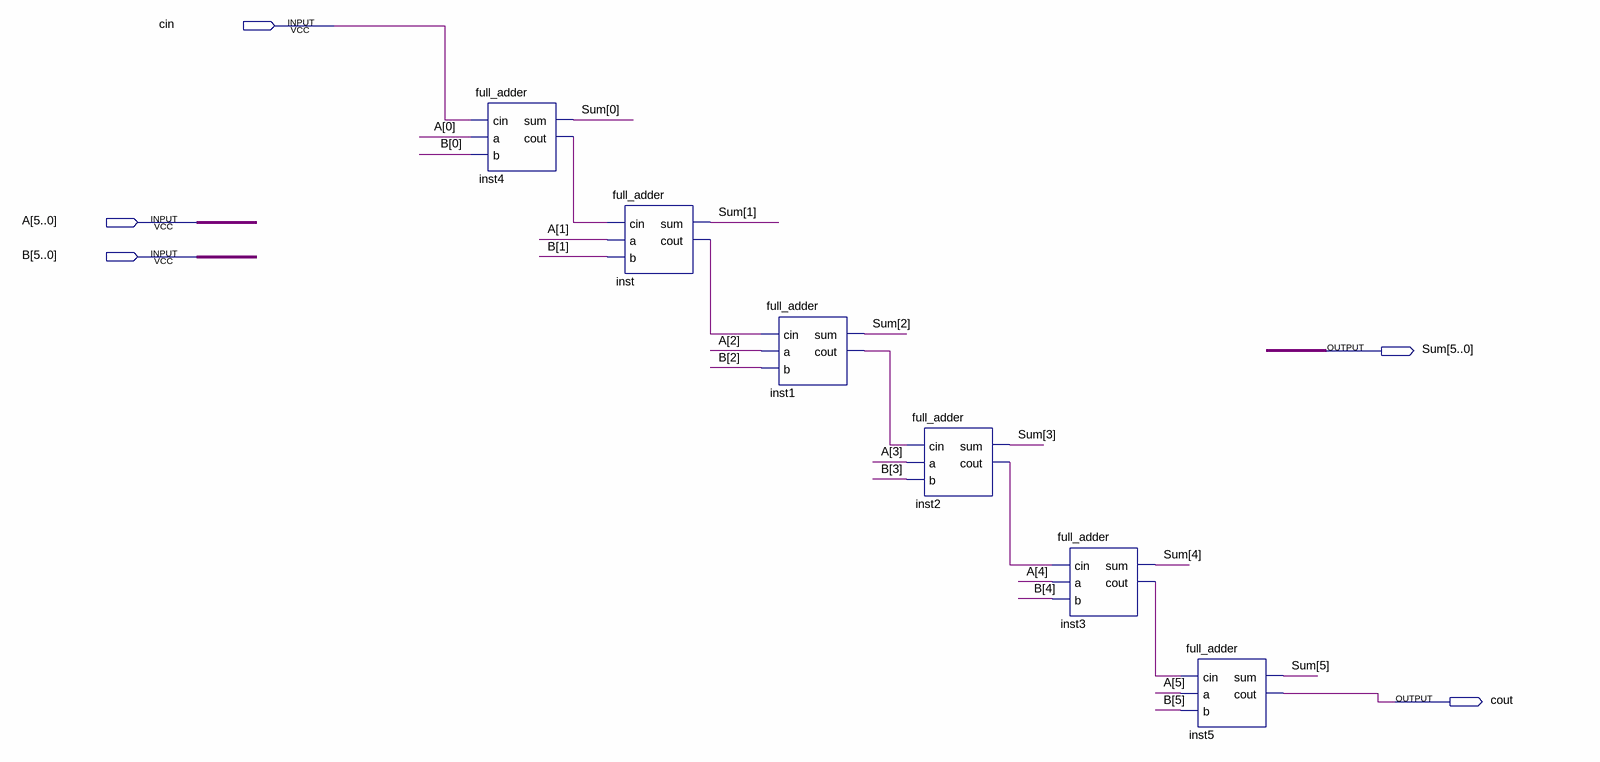
[diagram p0: schematic sheet]
// Quartus schematic adder_6bit.bdf as structural Verilog: 6 symbols, 5 pins
module adder_6bit (
  input  cin,
  input  [5:0] A,
  input  [5:0] B,
  output [5:0] Sum,
  output cout
);

  wire inst1_cout, inst2_cout, inst3_cout, inst4_cout, inst_cout;

  full_adder inst4 (.cin(cin), .a(A[0]), .b(B[0]), .sum(Sum[0]), .cout(inst4_cout));
  full_adder inst (.cin(inst4_cout), .a(A[1]), .b(B[1]), .sum(Sum[1]), .cout(inst_cout));
  full_adder inst1 (.cin(inst_cout), .a(A[2]), .b(B[2]), .sum(Sum[2]), .cout(inst1_cout));
  full_adder inst2 (.cin(inst1_cout), .a(A[3]), .b(B[3]), .sum(Sum[3]), .cout(inst2_cout));
  full_adder inst3 (.cin(inst2_cout), .a(A[4]), .b(B[4]), .sum(Sum[4]), .cout(inst3_cout));
  full_adder inst5 (.cin(inst3_cout), .a(A[5]), .b(B[5]), .sum(Sum[5]), .cout(cout));
endmodule
